# EAGLE design max_bell (EAGLE 6.5.0)
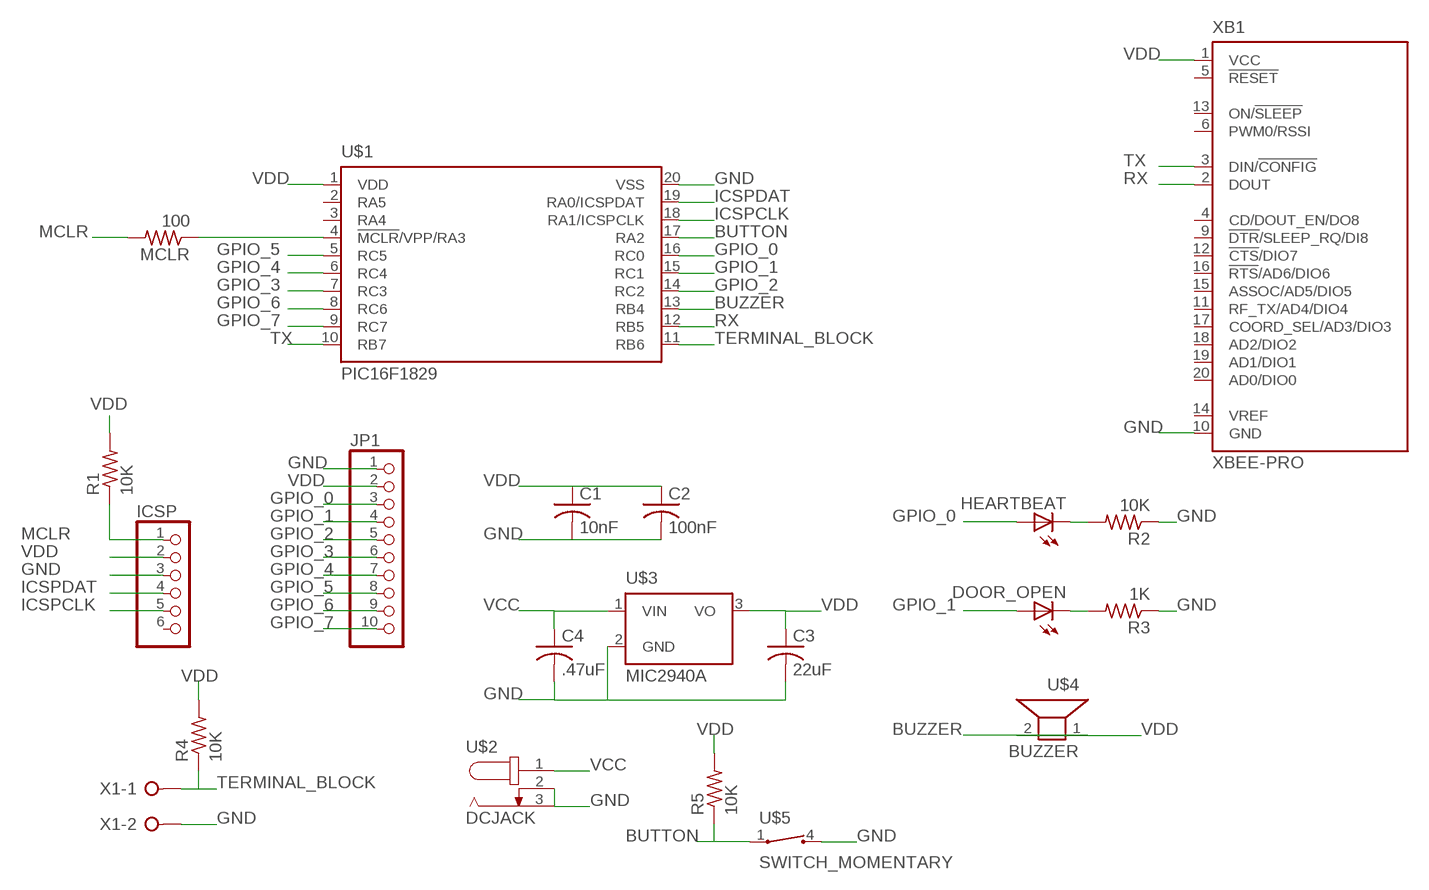
[diagram p0: schematic, sheet 1]

## Parts
C1  10nF  C-US050-035X075  [C050-035X075]
C2  100nF  C-US050-035X075  [C050-035X075]
C3  22uF  C-US050-035X075  [C050-035X075]
C4  .47uF  C-US050-035X075  [C050-035X075]
DOOR_OPEN  LED5MM  [LED5MM]
HEARTBEAT  LED5MM  [LED5MM]
ICSP  PINHD-1X6  [1X06]
JP1  PINHD-1X10  [1X10]
MCLR  100  R-US_0309/12  [0309/12]
R1  10K  R-US_0309/12  [0309/12]
R2  10K  R-US_0309/12  [0309/12]
R3  1K  R-US_0309/12  [0309/12]
R4  10K  R-US_0309/12  [0309/12]
R5  10K  R-US_0309/12  [0309/12]
U$1  PIC16F1829  [DIL20]
U$2  DCJACK  [DCJACKFP]
U$3  MIC2940A  [TO220V]
U$4  BUZZER  [BUZZER]
U$5  SWITCH_MOMENTARY  [MOMENTARY_SWITCH]
X1  W237-02P  [W237-132]
XB1  XBEE-PRO  [XBEE-PRO]

## Nets
BUTTON: R5.1 U$1.17(RA2) U$5.1
BUZZER: U$1.13(RB4) U$4.1
GND: C1.2 C2.2 C3.2 C4.2 ICSP.3 JP1.1 R2.1 R3.1 U$1.20(VSS) U$2.2 U$2.3 U$3.2(GND) U$5.4 X1.2 XB1.10(GND)
GPIO_0: HEARTBEAT.A JP1.3 U$1.16(RC0)
GPIO_1: DOOR_OPEN.A JP1.4 U$1.15(RC1)
GPIO_2: JP1.5 U$1.14(RC2)
GPIO_3: JP1.6 U$1.7(RC3)
GPIO_4: JP1.7 U$1.6(RC4)
GPIO_5: JP1.8 U$1.5(RC5)
GPIO_6: JP1.9 U$1.8(RC6)
GPIO_7: JP1.10 U$1.9(RC7)
ICSPCLK: ICSP.5 U$1.18(RA1/ICSPCLK)
ICSPDAT: ICSP.4 U$1.19(RA0/ICSPDAT)
MCLR: ICSP.1 MCLR.2 R1.1
N$1: MCLR.1 U$1.4(!MCLR!/VPP/RA3)
N$4: HEARTBEAT.K(C) R2.2
N$5: DOOR_OPEN.K(C) R3.2
RX: U$1.12(RB5) XB1.2(DOUT)
TERMINAL_BLOCK: R4.1 U$1.11(RB6) X1.1
TX: U$1.10(RB7) XB1.3(DIN/!CONFIG)
VCC: C4.1 U$2.1 U$3.1(VIN)
VDD: C1.1 C2.1 C3.1 ICSP.2 JP1.2 R1.2 R4.2 R5.2 U$1.1(VDD) U$3.3(VO) U$4.2 XB1.1(VCC)
Unconnected: ICSP.6 U$1.2(RA5) U$1.3(RA4) XB1.4(CD/DOUT_EN/DO8) XB1.5(!RESET) XB1.6(PWM0/RSSI) XB1.9(!DTR!/SLEEP_RQ/DI8) XB1.11(RF_TX/AD4/DIO4) XB1.12(!CTS!/DIO7) XB1.13(ON/!SLEEP) XB1.14(VREF) XB1.15(ASSOC/AD5/DIO5) XB1.16(!RTS!/AD6/DIO6) XB1.17(COORD_SEL/AD3/DIO3) XB1.18(AD2/DIO2) XB1.19(AD1/DIO1) XB1.20(AD0/DIO0)

## Library data of the parts
C1-C4 = rcl:C-US: CAPACITOR, American symbol
DOOR_OPEN HEARTBEAT = led:LED: LED OSRAM: - CHIPLED LG R971, LG N971, LY N971, LG Q971, LY Q971, LO R971, LY R971 LH N974, LH R974 LS Q976, LO Q976, LY Q976 LO Q996 - Hyper CHIPLED LW Q18S LB Q993, LB Q99A, LB R99A - SideLED LS A670, LO A670, LY A670, LG A670, LP A670 LB A673, LV A673, LT A673, LW A673 LH A674 LY A675 LS A676, LA A676, LO A676, LY A676, LW A676 LS A679, LY A679, LG A679 - Hyper Micro SIDELED® LS Y876, LA Y876, LO Y876, LY Y876 LT Y87S - SmartLED LW L88C, LW L88S LB L89C, LB L89S, LG L890 LS L89K, LO L89K, LY L89K LS L896, LA L896, LO L896, LY L896 - TOPLED LS T670, LO T670, LY T670, LG T670, LP T670 LSG T670, LSP T670, LSY T670, LOP T670, LYG T670 LG T671, LOG T671, LSG T671 LB T673, LV T673, LT T673, LW T673 LH T674 LS T676, LA T676, LO T676, LY T676, LB T676, LH T676, LSB T676, LW T676 LB T67C, LV T67C, LT T67C, LS T67K, LO T67K, LY T67K, LW E67C LS E67B, LA E67B, LO E67B, LY E67B, LB E67C, LV E67C, LT E67C LW T67C LS T679, LY T679, LG T679 LS T770, LO T770, LY T770, LG T770, LP T770 LB T773, LV T773, LT T773, LW T773 LH T774 LS E675, LA E675, LY E675, LS T675 LS T776, LA T776, LO T776, LY T776, LB T776 LHGB T686 LT T68C, LB T68C - Hyper Mini TOPLED® LB M676 - Mini TOPLED Santana® LG M470 LS M47K, LO M47K, LY M47K Source: http://www.osram.convergy.de LUXEON: - LUMILED® LXK2-PW12-R00, LXK2-PW12-S00, LXK2-PW14-U00, LXK2-PW14-V00 LXK2-PM12-R00, LXK2-PM12-S00, LXK2-PM14-U00 LXK2-PE12-Q00, LXK2-PE12-R00, LXK2-PE12-S00, LXK2-PE14-T00, LXK2-PE14-U00 LXK2-PB12-K00, LXK2-PB12-L00, LXK2-PB12-M00, LXK2-PB14-N00, LXK2-PB14-P00, LXK2-PB14-Q00 LXK2-PR12-L00, LXK2-PR12-M00, LXK2-PR14-Q00, LXK2-PR14-R00 LXK2-PD12-Q00, LXK2-PD12-R00, LXK2-PD12-S00 LXK2-PH12-R00, LXK2-PH12-S00 LXK2-PL12-P00, LXK2-PL12-Q00, LXK2-PL12-R00 Source: www.luxeon.com KINGBRIGHT: KA-3528ASYC Source: www.kingbright.com
ICSP = pinhead:PINHD-1X6: PIN HEADER
JP1 = pinhead:PINHD-1X10: PIN HEADER
MCLR R1-R5 = rcl:R-US_: RESISTOR, American symbol
U$1 = fritz:PIC16F1829: PIC16f1829 http://ww1.microchip.com/downloads/en/DeviceDoc/41440C.pdf
U$2 = fritz:DCJACK
U$3 = fritz:MIC2940A
U$4 = fritz:BUZZER: Mallory Sonalert Buzzer PB-12N23P-03Q
U$5 = fritz:SWITCH_MOMENTARY: C&K Momentary switches http://www.ck-components.com/13327/d6_9feb.pdf/
X1 = con-wago-508:W237-02P: WAGO SREW CLAMP; OC_FARNELL: unknown; OC_NEWARK: unknown
XB1 = maxstream:XBEE: XBee (TM) /XBee-PRO(TM) OEM RF Modules Source: MaxStream, Inc. xbee_productmanual.pdf; MPN: XBP24-AWI-001; OC_FARNELL: 1337916; OC_NEWARK: 42M2667

## Board
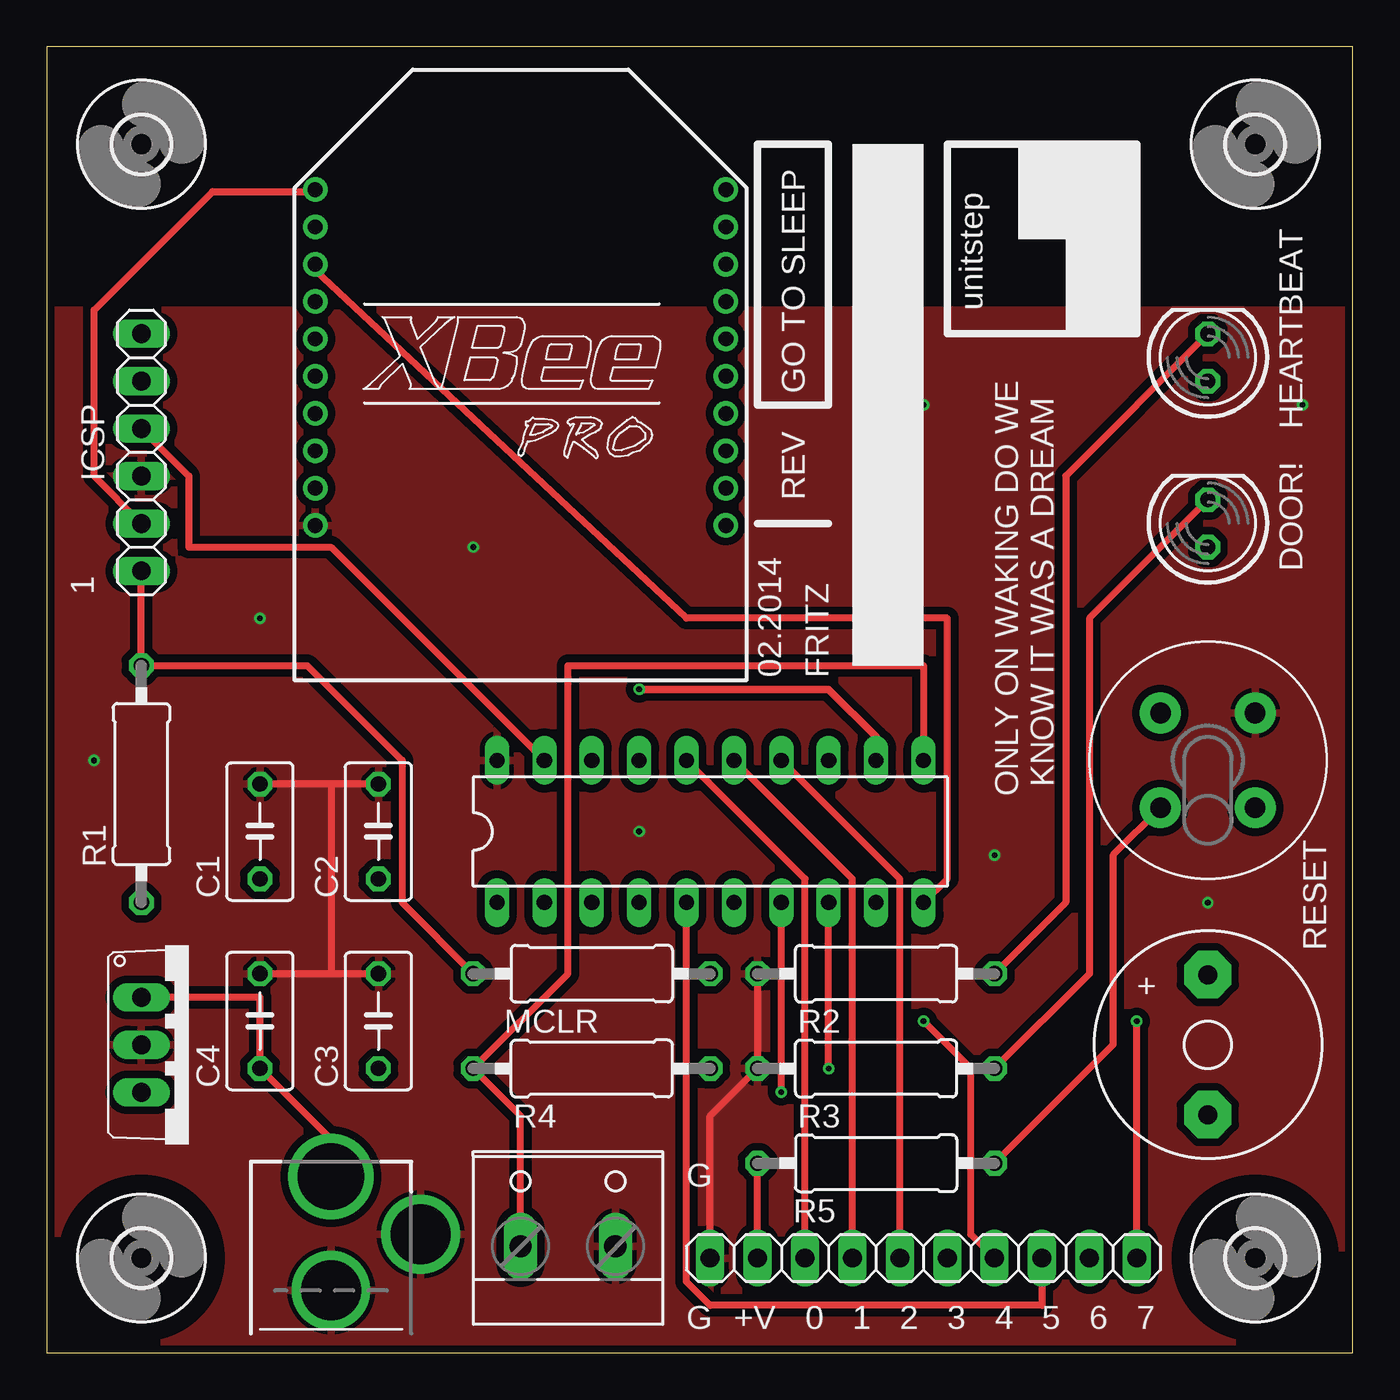
[diagram p1: board, top side]
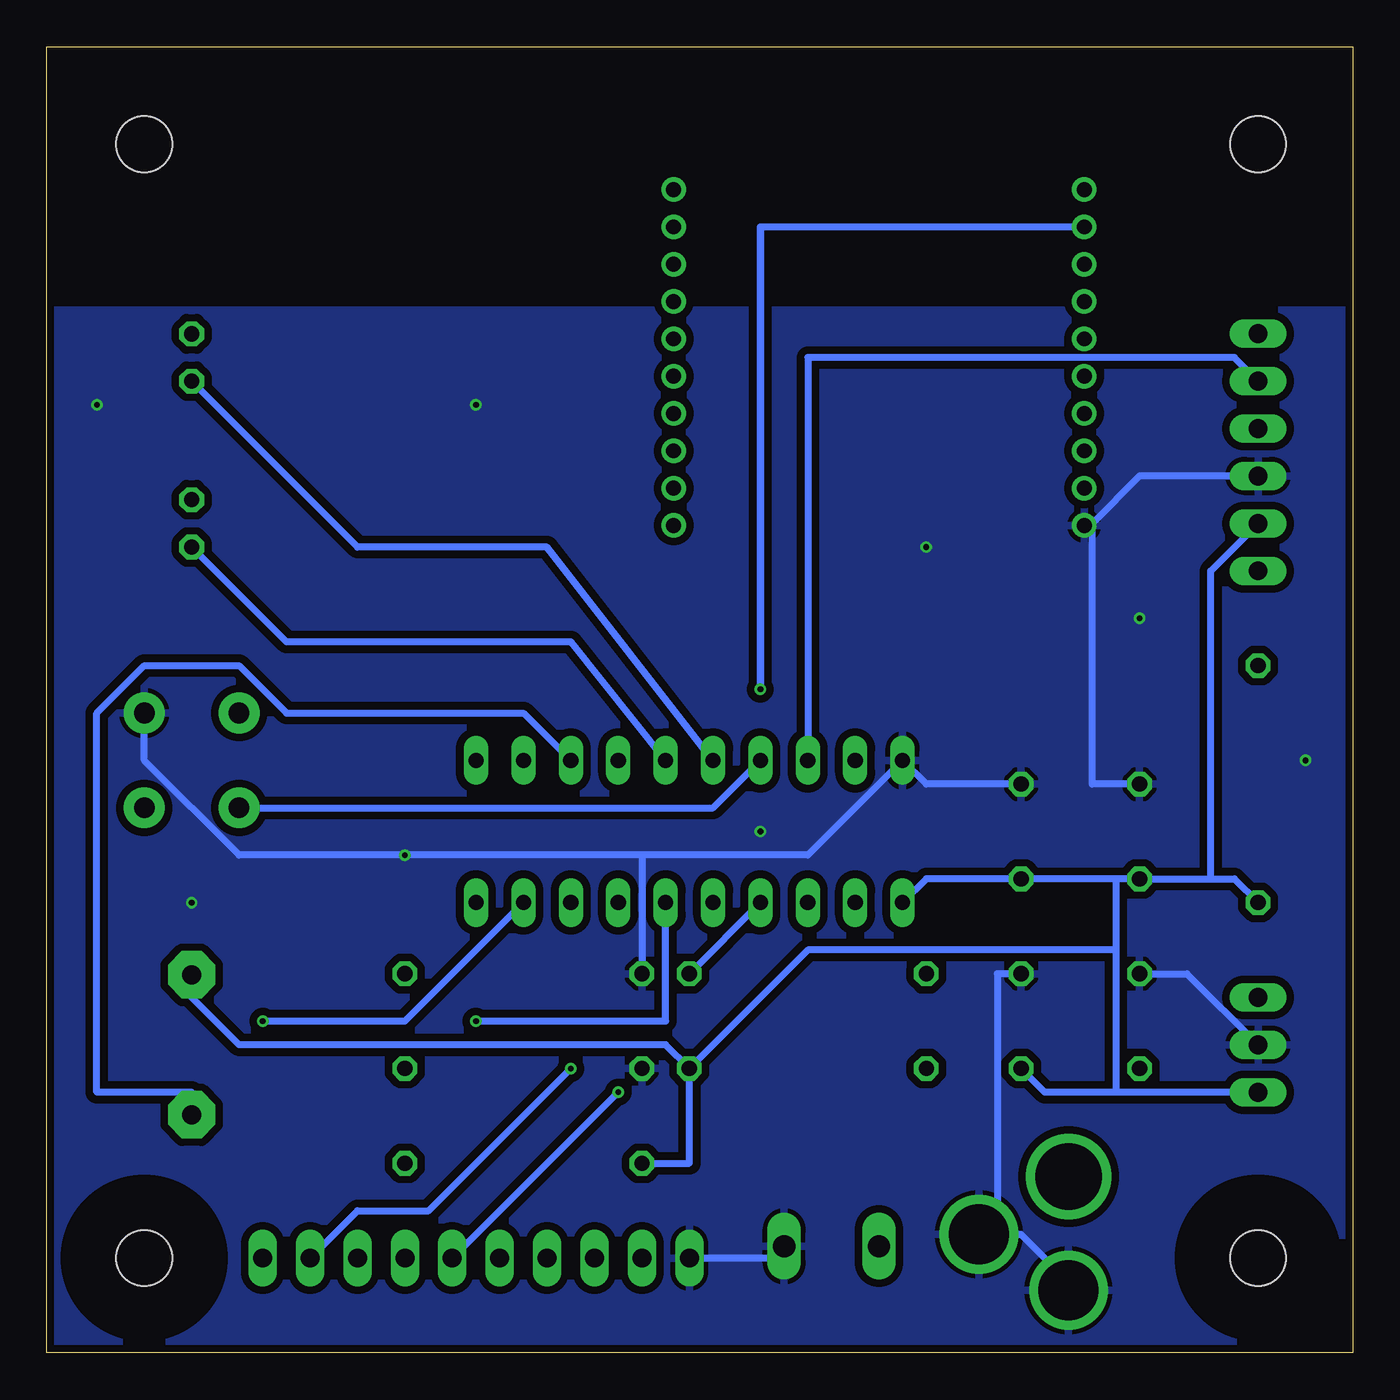
[diagram p2: board, bottom side, seen from below]

Size 70 x 70 mm. Coordinates in mm from the lower left corner, seen from the top.
Outline: 0,0 70,0 70,70 0,70 0,0
Copper layers (1*16): Top 0.035mm / dielectric 1.5mm / Bottom 0.035mm
Design rules "ITEADstudio_DRC": minimum track width 6mil, minimum drill 12mil, track to track 6mil, track to pad 6mil, pad to pad 6mil, via to via 6mil, smd to smd 0mil, copper to edge 10mil, drill to drill 10mil, minimum pad ring 10mil, minimum via ring 6mil, stop-mask expansion 2mil, vias tented up to drill 100mil, thermal gap 10mil

### Footprints (pad centres in the part's own frame; a part is rotated, then mirrored left to right if it is on the bottom)
C050-035X075 = drill 0.813 octagon: 1 -2.54,0; 2 2.54,0
LED5MM = drill 0.813 octagon: A -1.27,0; K 1.27,0
1X06 = drill 1.016 long: 1 -6.35,0; 2 -3.81,0; 3 -1.27,0; 4 1.27,0; 5 3.81,0; 6 6.35,0
1X10 = drill 1.016 long: 1 -11.43,0; 2 -8.89,0; 3 -6.35,0; 4 -3.81,0; 5 -1.27,0; 6 1.27,0; 7 3.81,0; 8 6.35,0; 9 8.89,0; 10 11.43,0
0309/12 = drill 0.813 octagon: 1 -6.35,0; 2 6.35,0
DIL20 = drill 0.813 long: 1 -11.43,-3.81; 2 -8.89,-3.81; 3 -6.35,-3.81; 4 -3.81,-3.81; 5 -1.27,-3.81; 6 1.27,-3.81; 7 3.81,-3.81; 8 6.35,-3.81; 9 8.89,-3.81; 10 11.43,-3.81; 11 11.43,3.81; 12 8.89,3.81; 13 6.35,3.81; 14 3.81,3.81; 15 1.27,3.81; 16 -1.27,3.81; 17 -3.81,3.81; 18 -6.35,3.81; 19 -8.89,3.81; 20 -11.43,3.81
DCJACKFP = drill 3.556 pad 4.318: 1 0,5.64 | drill 3.2 pad 3.81: 2 4.8,2.54; 3 0,-0.46
TO220V = drill 1.016 long: 1 -2.54,1.27; 2 0,1.27; 3 2.54,1.27
BUZZER = drill 1.016 pad 2.54 octagon: 1 -3.751,0; 2 3.751,0
MOMENTARY_SWITCH = drill 1.1 pad 2.184: 1 -2.54,2.54; 2 2.54,2.54; 3 -2.54,-2.54; 4 2.54,-2.54
3,0 = hole 3: 0,0
W237-132 = drill 1.194 long: 1 -2.54,-0.635; 2 2.54,-0.635
XBEE-PRO = drill 0.8 pad 1.27: 1 -11,9; 2 -11,7; 3 -11,5; 4 -11,3; 5 -11,1; 6 -11,-1; 7 -11,-3; 8 -11,-5; 9 -11,-7; 10 -11,-9; 11 11,-9; 12 11,-7; 13 11,-5; 14 11,-3; 15 11,-1; 16 11,1; 17 11,3; 18 11,5; 19 11,7; 20 11,9

### Placement (x,y rotation side)
C1  11.43,27.94 90 top
C2  17.78,27.94 90 top
C3  17.78,17.78 90 top
C4  11.43,17.78 90 top
DOOR_OPEN  62.23,44.45 90 top
HEARTBEAT  62.23,53.34 90 top
ICSP  5.08,48.26 90 top
JP1  46.99,5.08 0 top
MCLR  29.21,20.32 180 top
R1  5.08,30.48 270 top
R2  44.45,20.32 0 top
R3  44.45,15.24 0 top
R4  29.21,15.24 0 top
R5  44.45,10.16 180 top
U$1  35.56,27.94 0 top
U$2  15.24,3.81 0 top
U$3  3.81,16.51 270 top
U$4  62.23,16.51 90 top
U$5  62.23,31.75 90 top
U$6  [3,0]  5.08,64.77 0 top
U$7  [3,0]  64.77,64.77 0 top
U$8  [3,0]  64.77,5.08 0 top
U$9  [3,0]  5.08,5.08 0 top
X1  27.94,6.35 0 top
XB1  25.4,53.34 0 top

### Tracks (layer width: path | path; a pad name or v marks a point on that pad's centre or on a via)
BUTTON
  Top 0.381: R5.1 57.15,16.51 57.15,26.67 U$5.1
  Bottom 0.381: U$1.17 34.29,29.21 U$5.1
BUZZER
  Bottom 0.381: U$1.13 44.45,34.29 57.15,34.29 59.69,36.83 64.77,36.83 67.31,34.29 67.31,13.97 62.23,13.97 U$4.1
GND  (via drill 0.3)
  Top 0.381: R2.1 R3.1 35.56,12.7 JP1.1 | C3.2 15.24,20.32 | 15.24,20.32 C4.2 | C2.2 15.24,30.48 | 15.24,30.48 C1.2 | 15.24,30.48 15.24,20.32
  Bottom 0.381: 19.05,6.35 17.78,6.35 15.24,3.81 U$2.3 | JP1.1 30.48,5.08 X1.2 | U$3.2 8.89,20.32 C4.2 | 13.97,44.45 11.43,46.99 ICSP.3 | C2.2 22.86,30.48 U$1.20 29.21,26.67 38.1,26.67 | U$5.4 64.77,31.75 59.69,26.67 v50.8,26.67 38.1,26.67 | 13.97,44.45 13.97,30.48 C1.2 | 13.97,44.45 XB1.10 | 38.1,26.67 R2.1 | 19.05,6.35 19.05,20.32 C3.2 | 19.05,6.35 U$2.2
  other vias: 67.31,50.8 46.99,50.8 22.86,43.18 11.43,39.37 2.54,31.75 31.75,27.94 62.23,24.13
  pour Bottom (isolate 0.406): 0,0 0,55.88 69.85,55.88 69.85,0
  pour Top (isolate 0.406): 0,0 0,55.88 69.85,55.88 69.85,0
GPIO_0
  Top 0.381: U$1.16 40.64,25.4 JP1.3
  Bottom 0.381: HEARTBEAT.A 53.34,43.18 43.18,43.18 U$1.16
GPIO_1
  Top 0.381: U$1.15 43.18,25.4 JP1.4
  Bottom 0.381: DOOR_OPEN.A 57.15,38.1 41.91,38.1 U$1.15
GPIO_2
  Top 0.381: U$1.14 45.72,25.4 JP1.5
GPIO_3  (via drill 0.3)
  Top 0.381: v39.37,13.97 U$1.7
  Bottom 0.381: JP1.6 v39.37,13.97
GPIO_4  (via drill 0.3)
  Top 0.381: v46.99,17.78 49.53,15.24 49.53,6.35 JP1.7
  Bottom 0.381: U$1.6 36.83,17.78 v46.99,17.78
GPIO_5
  Top 0.381: U$1.5 34.29,3.81 35.56,2.54 53.34,2.54 JP1.8
GPIO_6  (via drill 0.3)
  Top 0.381: v41.91,15.24 U$1.8
  Bottom 0.381: v41.91,15.24 49.53,7.62 53.34,7.62 JP1.9
GPIO_7  (via drill 0.3)
  Top 0.381: JP1.10 v58.42,17.78
  Bottom 0.381: U$1.9 50.8,17.78 v58.42,17.78
ICSPCLK
  Bottom 0.381: U$1.18 29.21,53.34 6.35,53.34 ICSP.5
ICSPDAT
  Top 0.381: U$1.19 15.24,43.18 7.62,43.18 7.62,46.99 ICSP.4
MCLR
  Top 0.381: MCLR.2 19.05,24.13 19.05,31.75 13.97,36.83 R1.1 ICSP.1
N$1
  Bottom 0.381: MCLR.1 U$1.4
N$4
  Top 0.381: R2.2 54.61,24.13 54.61,46.99 HEARTBEAT.K
N$5
  Top 0.381: R3.2 55.88,20.32 55.88,39.37 DOOR_OPEN.K
RX  (via drill 0.3)
  Top 0.406: U$1.12 44.45,33.02 41.91,35.56 v31.75,35.56
  Bottom 0.406: v31.75,35.56 31.75,60.33 XB1.2
TERMINAL_BLOCK
  Top 0.381: X1.1 25.4,12.7 R4.1 27.94,20.32 27.94,36.83 46.99,36.83 U$1.11
TX
  Top 0.381: U$1.10 48.26,25.4 48.26,39.37 34.29,39.37 13.97,58.42 XB1.3
VCC
  Top 0.381: U$2.1 15.24,11.43 C4.1 11.43,19.05 U$3.1
VDD
  Top 0.381: JP1.2 R5.2 | ICSP.2 2.54,46.99 2.54,55.88 8.89,62.23 13.97,62.23 XB1.1
  Bottom 0.381: R4.2 35.56,10.16 R5.2 | R4.2 36.83,16.51 59.69,16.51 62.23,19.05 U$4.2 | C3.1 16.51,13.97 12.7,13.97 | U$3.3 12.7,13.97 | R1.2 6.35,25.4 7.62,25.4 | 7.62,25.4 C1.1 12.7,25.4 | 12.7,25.4 C2.1 22.86,25.4 U$1.1 | 12.7,25.4 12.7,21.59 | 12.7,21.59 12.7,13.97 | ICSP.2 7.62,41.91 7.62,25.4 | R4.2 29.21,21.59 12.7,21.59

### Text on the board
tNames: unitstep | GO TO SLEEP | HEARTBEAT | REV | DOOR! | 1 | 02.2014 | FRITZ | ONLY ON WAKING DO WE / KNOW IT WAS A DREAM | RESET | + | G | G | +V | 0 | 1 | 2 | 3 | 4 | 5 | 6 | 7